# Altium schematic sheet BUCK_Converter.SchDoc
size 400 x 299 mm; SheetNumber: 1; SheetTotal: 1
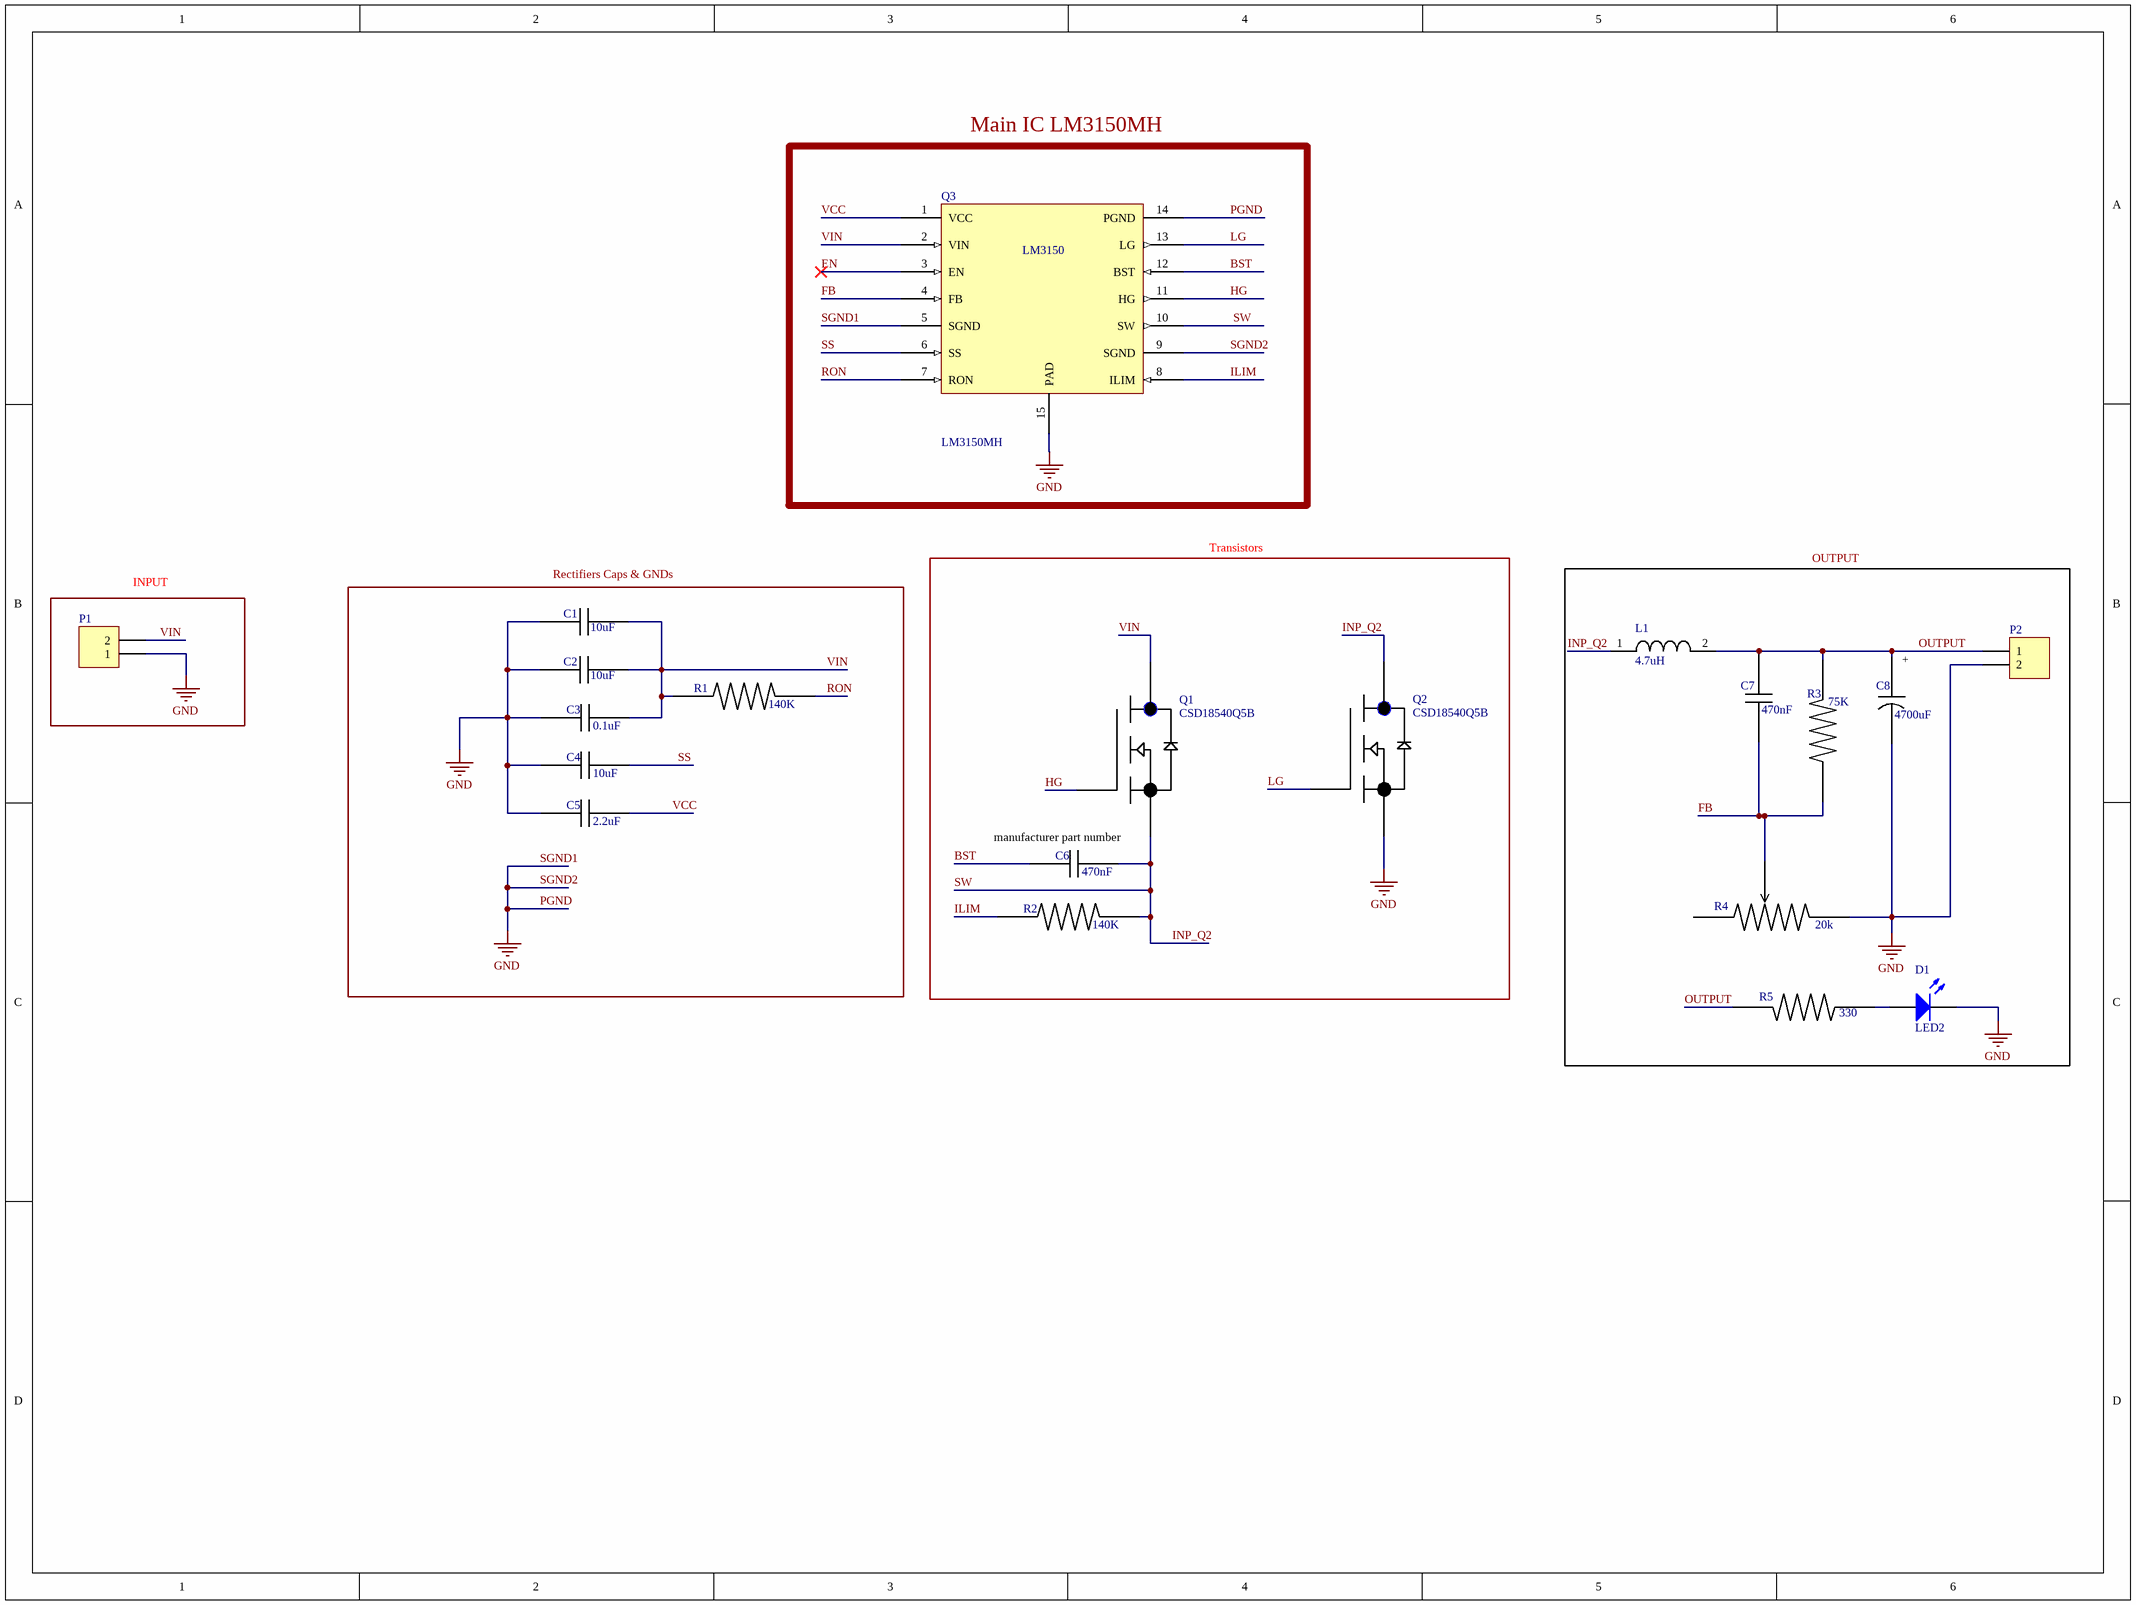
[diagram p0: BUCK_Converter.SchDoc]

## Parts
C1  10uF  [1206_cap]
C2  10uF  [1206_cap]
C3  0.1uF  [1206_cap]
C4  10uF  [1206_cap]
C5  2.2uF  [1206_cap]
C6  470nF  [1206_cap]
C7  470nF  [1206_cap]
C8  4700uF  [CAp]
D1  LED2  [3.2X1.6X1.1]
L1  4.7uH  [coill]
P1  Header 2  [HDR1X2]  (value not drawn)
P2  Header 2  [HDR1X2]  (value not drawn)
Q1  CSD18540Q5B  [CSD18540Q5B]
Q2  CSD18540Q5B  [CSD18540Q5B]
Q3  LM3150MH  [LM3150MH]
R1  140K  [1206_res]
R2  140K  [1206_res]
R3  75K  [1206_res]
R4  20k  [pot_smd]
R5  330  [1206_res]

## Blocks framed on the sheet
Main IC LM3150MH: Q3
INPUT: P1
Rectifiers Caps & GNDs: C1-C5 R1
Transistors: C6 Q1 Q2 R2
OUTPUT: C7 C8 D1 L1 P2 R3-R5

## Nets
PGND: C1.1(+) C2.1(+) C3.2(-) C4.1(+) C5.1(+) C8.2(-) D1.2(K) P1.1 P2.2 Q2.1 Q3.5(SGND) Q3.9(SGND) Q3.14(PGND) Q3.15(PAD) R4.3  [also labelled GND, SGND1, SGND2]
BST: C6.1(+) Q3.12(BST)
EN: Q3.3(EN)
FB: C7.1(+) Q3.4(FB) R3.1 R4.2
HG: Q1.2 Q3.11(HG)
ILIM: Q3.8(ILIM) R2.1
INP_Q2: C6.2(-) L1.1 Q1.1 Q2.3 Q3.10(SW) R2.2  [also labelled SW]
LG: Q2.2 Q3.13(LG)
OUTPUT: C7.2(-) C8.1(+) L1.2 P2.1 R3.2 R5.2
RON: Q3.7(RON) R1.2
SS: C4.2(-) Q3.6(SS)
VCC: C5.2(-) Q3.1(VCC)
VIN: C1.2(-) C2.2(-) C3.1(+) P1.2 Q1.3 Q3.2(VIN) R1.1
NetD1_1: D1.1(A) R5.1

Not connected (* = marked no-connect by the designer): R4 1

## Notes on the sheet
- (near C6) manufacturer part number
- (in symbol LM3150MH) LM3150

## Library data of the parts
C1 C2 = Capacitor: CAP CER 10UF 16V X5R 1206; MF: Samsung Electro-Mechanics; PN: CL31A106MOHNNNE
C3 = Capacitor_smd: CAP CER 0.1UF 50V X7R 1206; PN: CL31B104KBCNNNC; MF: Samsung Electro-Mechanics
C4 = Capacitor_smd: CAP CER 10UF 16V X5R 1206; MF: Samsung Electro-Mechanics; PN: CL31A106MOHNNNE
C5 = Capacitor_smd: CAP CER 2.2UF 16V X7R 1206; PN: CL31B225KOHNNNE; MF: Samsung Electro-Mechanics
C6 C7 = Capacitor_smd: CAP CER 0.047UF 50V X7R 1206; PN: CL31B473KBCNNNC; MF: Samsung Electro-Mechanics
C8 = Capacitor_al: CAP ALUM 4700UF 20% 10V SMD; MF: Panasonic; PN: EEV-FK1A472M
D1 = LED2: Typical RED, GREEN, YELLOW, AMBER GaAs LED
L1 = Coil: FIXED IND 4.7UH 3A 40.3 MOHM SMD; MF: Taiyo Yuden; PN: NR6028T4R7M
P1 P2 = Header 2: Header, 2-Pin
Q1 Q2 = CSD18540Q5B: MOSFET N-CH 60V 100A 8VSON; MF: Texas Instruments; PN: CSD18540Q5B
Q3 = LM3150MH: IC REG CTRLR BUCK 14TSSOP; PN: LM3150MH/NOPB; MF: Texas Instruments
R1 R2 = resistor_smd: RES SMD 140K OHM 1% 1/4W 1206; PN: CRCW1206140KFKEA; MF: Vishay Dale
R3 = resistor_smd: RES SMD 75K OHM 1% 1/20W 0201; PN: CRCW120670KFKEA; MF: Vishay Dale
R4 = pot: 20 kOhms 0.5W, 1/2W Gull Wing Surface Mount Trimmer Potentiometer Cermet 1.0 Turn Top Adjustment; PN: 3361P-1-203GLF; MF: Bourns Inc.
R5 = resistor_smd: RES SMD 330 OHM 1% 1/20W 0201; PN: CRCW1206330RFKEAC; MF: Vishay Dale